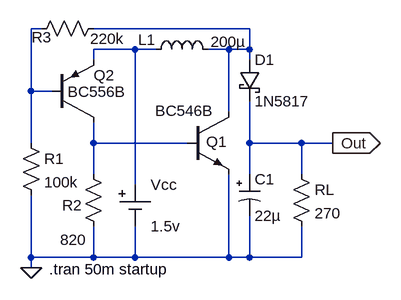
[diagram p0: schematic Conv1v5.asc]
Conv1v5.asc, the LTspice schematic file:
Version 4
SHEET 1 880 680
WIRE 16 112 0 112
WIRE 336 112 96 112
WIRE 160 144 96 144
WIRE 192 144 160 144
WIRE 304 144 272 144
WIRE 336 144 336 112
WIRE 336 144 304 144
WIRE 96 160 96 144
WIRE 336 160 336 144
WIRE 0 208 0 112
WIRE 32 208 0 208
WIRE 304 240 304 144
WIRE 0 288 0 208
WIRE 96 288 96 256
WIRE 240 288 96 288
WIRE 336 288 336 224
WIRE 416 288 336 288
WIRE 464 288 416 288
WIRE 96 336 96 288
WIRE 336 336 336 288
WIRE 416 336 416 288
WIRE 160 352 160 144
WIRE 0 464 0 368
WIRE 96 464 96 416
WIRE 96 464 0 464
WIRE 160 464 160 416
WIRE 160 464 96 464
WIRE 304 464 304 336
WIRE 304 464 160 464
WIRE 336 464 336 400
WIRE 336 464 304 464
WIRE 416 464 416 416
WIRE 416 464 336 464
WIRE 0 480 0 464
FLAG 0 480 0
FLAG 464 288 Out
IOPIN 464 288 Out
SYMBOL npn2 240 240 R0
WINDOW 0 29 46 Left 0
WINDOW 3 -49 -2 Left 0
SYMATTR InstName Q1
SYMATTR Value BC546B
SYMBOL Miscel\\pnp2 32 256 M180
WINDOW 0 64 72 Left 0
WINDOW 3 24 47 Left 0
SYMATTR InstName Q2
SYMATTR Value BC556B
SYMBOL res -16 272 R0
SYMATTR InstName R1
SYMATTR Value 100k
SYMBOL res 80 320 R0
WINDOW 0 -32 64 Left 0
WINDOW 3 -35 117 Left 0
SYMATTR InstName R2
SYMATTR Value 820
SYMBOL res 112 96 R90
WINDOW 0 45 96 VBottom 0
WINDOW 3 16 -5 VTop 0
SYMATTR InstName R3
SYMATTR Value 220k
SYMBOL ind 176 160 R270
WINDOW 0 15 2 VTop 0
WINDOW 3 43 127 VBottom 0
SYMATTR InstName L1
SYMATTR Value 200µ
SYMBOL schottky 320 160 R0
SYMATTR InstName D1
SYMATTR Value 1N5817
SYMATTR Description Diode
SYMATTR Type diode
SYMBOL polcap 320 336 R0
WINDOW 3 24 64 Left 0
SYMATTR InstName C1
SYMATTR Value 22µ
SYMATTR Description Capacitor
SYMATTR Type cap
SYMATTR SpiceLine V=16 Irms=460m Rser=0.16 MTBF=3000 Lser=0 mfg="Nichicon" pn="UPL1C221MPH" type="Al electrolytic" ppPkg=1
SYMBOL Misc\\cell 160 352 R0
SYMATTR InstName Vcc
SYMATTR Value 1.5v
SYMBOL res 400 320 R0
SYMATTR InstName RL
SYMATTR Value 270
TEXT 28 482 Left 0 !.tran 50m startup

The netlist it stands for:
* Conv1v5.asc
Q1 N002 N004 0 0 BC546B
Q2 N004 N001 N003 0 BC556B
R1 N001 0 100k
R2 N004 0 820
R3 N002 N001 220k
L1 N003 N002 200µ
D1 N002 Out 1N5817
C1 Out 0 22µ V=16 Irms=460m Rser=0.16 MTBF=3000 Lser=0 mfg="Nichicon" pn="UPL1C221MPH" type="Al electrolytic" ppPkg=1
Vcc N003 0 1.5v
RL Out 0 270
.model D D
.lib standard.dio
.model NPN NPN
.model PNP PNP
.lib standard.bjt
.tran 50m startup
.backanno
.end